# EAGLE design ESP8266-EVB_Rev_A (EAGLE 4.16)
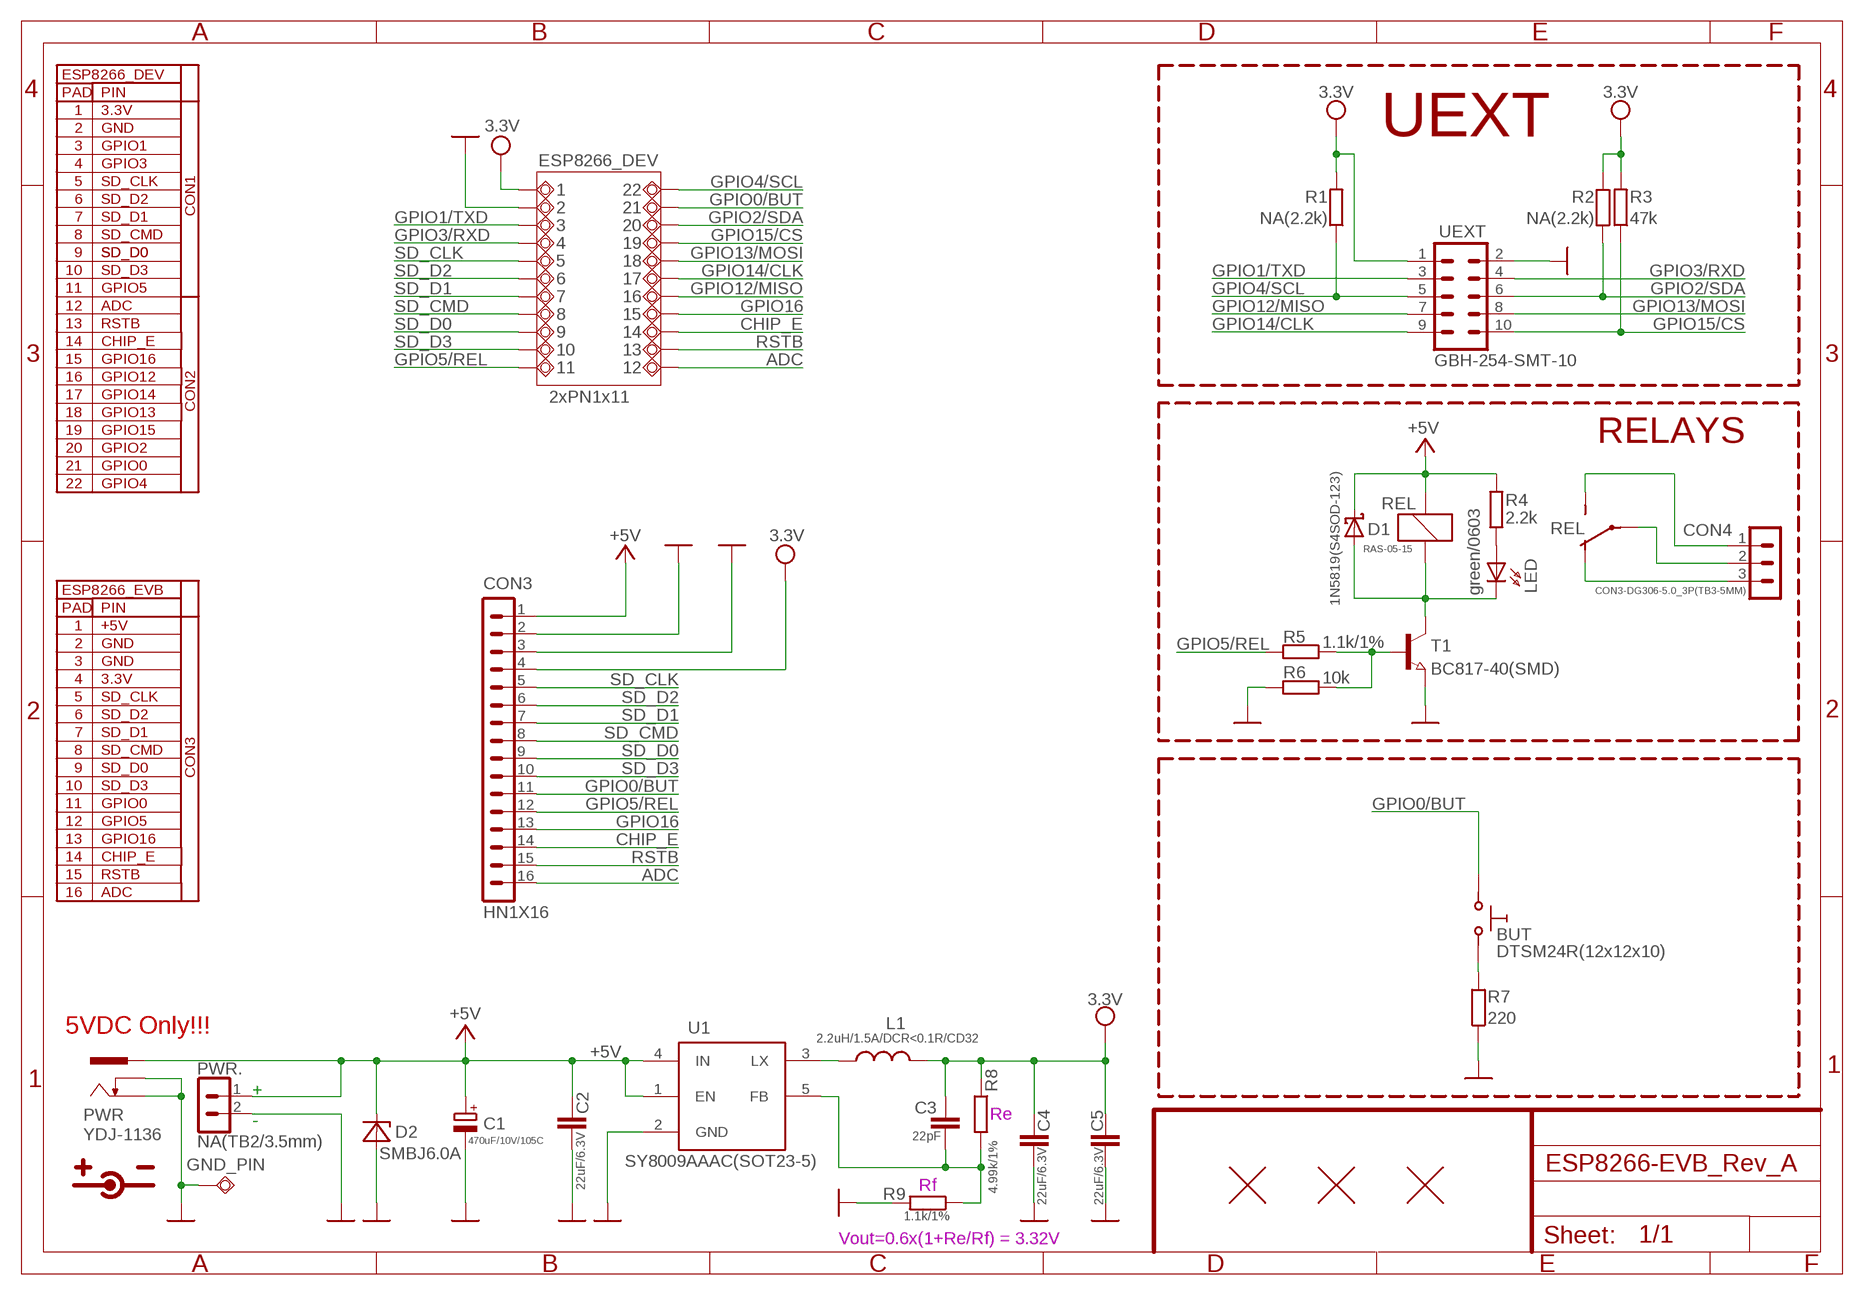
[diagram p0: schematic, sheet 1]

## Parts
1  TESTPAD40/60/SQUARE  [TESTPAD40/66/SQUARE]
2  TESTPAD40/66  [TESTPAD40/66]
3  TESTPAD40/66  [TESTPAD40/66]
4  TESTPAD40/66  [TESTPAD40/66]
5  TESTPAD40/66  [TESTPAD40/66]
6  TESTPAD40/66  [TESTPAD40/66]
7  TESTPAD40/66  [TESTPAD40/66]
8  TESTPAD40/66  [TESTPAD40/66]
9  TESTPAD40/66  [TESTPAD40/66]
10  TESTPAD40/66  [TESTPAD40/66]
11  TESTPAD40/66  [TESTPAD40/66]
12  TESTPAD40/66  [TESTPAD40/66]
13  TESTPAD40/66  [TESTPAD40/66]
14  TESTPAD40/66  [TESTPAD40/66]
15  TESTPAD40/66  [TESTPAD40/66]
16  TESTPAD40/66  [TESTPAD40/66]
17  TESTPAD40/66  [TESTPAD40/66]
18  TESTPAD40/66  [TESTPAD40/66]
19  TESTPAD40/66  [TESTPAD40/66]
20  TESTPAD40/66  [TESTPAD40/66]
21  TESTPAD40/66  [TESTPAD40/66]
22  TESTPAD40/66  [TESTPAD40/66]
BUT  DTSM24R(12x12x10)  SW-TAKTSS  [SW_TAKT12X12SS]
C1  470uF/10V/105C  CPOL-EUE2.5-6.3  [E2,5-6,3]
C2  22uF/6.3V  C-EUC0603_DWS  [C0603_DWS]
C3  22pF  C-EUC0603_DWS  [C0603_DWS]
C4  22uF/6.3V  C-EUC0603_DWS  [C0603_DWS]
C5  22uF/6.3V  C-EUC0603_DWS  [C0603_DWS]
CON3  HN1X16  CON16-HN1X16  [HN1X16]
CON4  CON3-DG306-5.0_3P(TB3-5MM)  [DG306-5.0_3P]
D1  1N5819(S4SOD-123)  SCHOTKKY7.62SS-1N5819(S4SOD-123)  [SOD-123]
D2  SMBJ6.0A  SMBJ16A  [DO214AA]
GND_PIN  TESTPAD3  [TEST_PAD40/70/SQUARE]
L1  2.2uH/1.5A/DCR<0.1R/CD32  L-CD32  [CD32]
LED  green/0603  LED0603DWS_L  [LED-0603_L]
PWR  YDJ-1136  PWR-JAKPWR_JACK_UNI_MILLING  [PWR_JACK_UNI_MILLING]
PWR.  NA(TB2/3.5mm)  CON2-DG306-5.0_2P(TB2-5MM)  [DG306-5.0_2P]
R1  NA(2.2k)  R-EU_R0603_5MIL_DWS  [R0603_5MIL_DWS]
R2  NA(2.2k)  R-EU_R0603_5MIL_DWS  [R0603_5MIL_DWS]
R3  47k  R-EU_R0603_5MIL_DWS  [R0603_5MIL_DWS]
R4  2.2k  R-EU_R0603_5MIL_DWS  [R0603_5MIL_DWS]
R5  1.1k/1%  R-EU_R0603_5MIL_DWS  [R0603_5MIL_DWS]
R6  10k  R-EU_R0603_5MIL_DWS  [R0603_5MIL_DWS]
R7  220  R-EU_R0603_5MIL_DWS  [R0603_5MIL_DWS]
R8  4.99k/1%  R-EU_R0603_5MIL_DWS  [R0603_5MIL_DWS]
R9  1.1k/1%  R-EU_R0603_5MIL_DWS  [R0603_5MIL_DWS]
REL  RAS-05-15  RELAYH200F  [H200-FAT]
T1  BC817-40(SMD)  NPN-TRANSISTOR_SOT23  [SOT23]
U1  SY8009AAAC(SOT23-5)  SY8008  [SOT23-5]
U$1  FIDUCIAL  [FIDUCIAL-1X3]
U$2  FIDUCIAL  [FIDUCIAL-1X3]
U$8  FIDUCIAL  [FIDUCIAL-1X3]
UEXT  GBH-254-SMT-10  ML10  [ML10-MALE]

## Nets
+5V: C1.+ C2.1 CON3.1 D1.C D2.C PWR.+ PWR..1 R4.2 REL.1 U1.1(EN) U1.4(IN)
ADC: 12.P$1(PP) CON3.16
CHIP_E: 14.P$1(PP) CON3.14
COM [REL]: CON4.2 REL.P(CONTACTS:P)
GND: 2.P$1(PP) C1.- C2.2 C4.2 C5.2 CON3.2 CON3.3 D2.A GND_PIN.P$1(PP) PWR.- PWR.-- PWR..2 R6.2 R7.1 R9.2 T1.2(E) U1.2(GND) UEXT.2
GPIO0/BUT: 21.P$1(PP) BUT.P$2 CON3.11
GPIO1/TXD: 3.P$1(PP) UEXT.3
GPIO2/SDA: 20.P$1(PP) R2.1 UEXT.6
GPIO3/RXD: 4.P$1(PP) UEXT.4
GPIO4/SCL: 22.P$1(PP) R1.1 UEXT.5
GPIO5/REL: 11.P$1(PP) CON3.12 R5.2
GPIO12/MISO: 16.P$1(PP) UEXT.7
GPIO13/MOSI: 18.P$1(PP) UEXT.8
GPIO14/CLK: 17.P$1(PP) UEXT.9
GPIO15/CS: 19.P$1(PP) R3.1 UEXT.10
GPIO16: 15.P$1(PP) CON3.13
N$1: LED.A R4.1
N$26: R5.1 R6.1 T1.1(B)
N$29: BUT.P$1 R7.2
N$44 [pwr2]: D1.A LED.C REL.2 T1.3(C)
N$64: L1.1 U1.3(LX)
N$66: C3.2 R8.2 R9.1 U1.5(FB)
NC [REL]: CON4.3 REL.O(CONTACTS:O)
NO [REL]: CON4.1 REL.S(CONTACTS:S)
RSTB: 13.P$1(PP) CON3.15
SD_CLK: 5.P$1(PP) CON3.5
SD_CMD: 8.P$1(PP) CON3.8
SD_D0: 9.P$1(PP) CON3.9
SD_D1: 7.P$1(PP) CON3.7
SD_D2: 6.P$1(PP) CON3.6
SD_D3: 10.P$1(PP) CON3.10
VCC: 1.P$1(PP) C3.1 C4.1 C5.1 CON3.4 L1.2 R1.2 R2.2 R3.2 R8.1 UEXT.1 ; supply symbol labelled 3.3V

## Notes on the sheet
- ESP8266_DEV
- PAD | PIN
- 1 | 3.3V
- 2 | GND | UEXT
- 3 | GPIO1
- 4 | GPIO3 | ESP8266_DEV
- 5 | SD_CLK
- 6 | SD_D2
- CON1
- 7 | SD_D1
- 8 | SD_CMD
- 9 | SD_D0 | SD_D0
- 10 | SD_D3
- 11 | GPIO5
- 12 | ADC
- 13 | RSTB
- 14 | CHIP_E
- 15 | GPIO16
- 16 | GPIO12
- 17 | GPIO14 | 2xPN1x11
- CON2
- 18 | GPIO13
- 19 | GPIO15
- RELAYS
- 20 | GPIO2
- 21 | GPIO0
- 22 | GPIO4
- ESP8266_EVB
- PAD | PIN
- 1 | +5V
- 2 | GND
- 3 | GND
- 4 | 3.3V
- 5 | SD_CLK
- 6 | SD_D2
- 7 | SD_D1
- 8 | SD_CMD
- 9 | SD_D0
- CON3
- 10 | SD_D3
- 11 | GPIO0
- 12 | GPIO5
- 13 | GPIO16
- 14 | CHIP_E
- 15 | RSTB
- 16 | ADC
- 5VDC Only!!!
- +
- -
- Re
- Rf
- Vout=0.6x(1+Re/Rf) = 3.32V

## Library data of the parts
1-22 GND_PIN = gogo:TESTPAD: drill 40mils, diameter 70mils
BUT = gogo:SW-TAKT
C1 = rcl:CPOL-EU: POLARIZED CAPACITOR, European symbol
C2-C5 = rcl:C-EU: CAPACITOR, European symbol
CON3 = Penko:CON16
CON4 = Penko:CON3
D1 = gogo:SCHOTKKY7.62SS
D2 = OLIMEX_DISCRET:SMBJ16A
L1 = OLIMEX_DISCRET:L
LED = DOUBLE-SIDE:LED
PWR = gogo:PWR-JAK
PWR. = Penko:CON2
R1-R9 = rcl:R-EU_: RESISTOR, European symbol
REL = DOUBLE-SIDE:RELAY: RELAY
T1 = semicon-smd-ipc:NPN-TRANSISTOR_: NPN TRANSISTOR
U1 = OLIMEX_IC:SY8008
U$1 U$2 U$8 = SparkFunEagle-6-6-07:FIDUCIAL: Fiducial Alignment Points Various fiducial points for machine vision alignment.
UEXT = con-harting-ml:ML10: HARTING

## Net classes
2 pwr2: width 0.508 mm
4 REL: width 2.032 mm, drill 2.54 mm

## Board
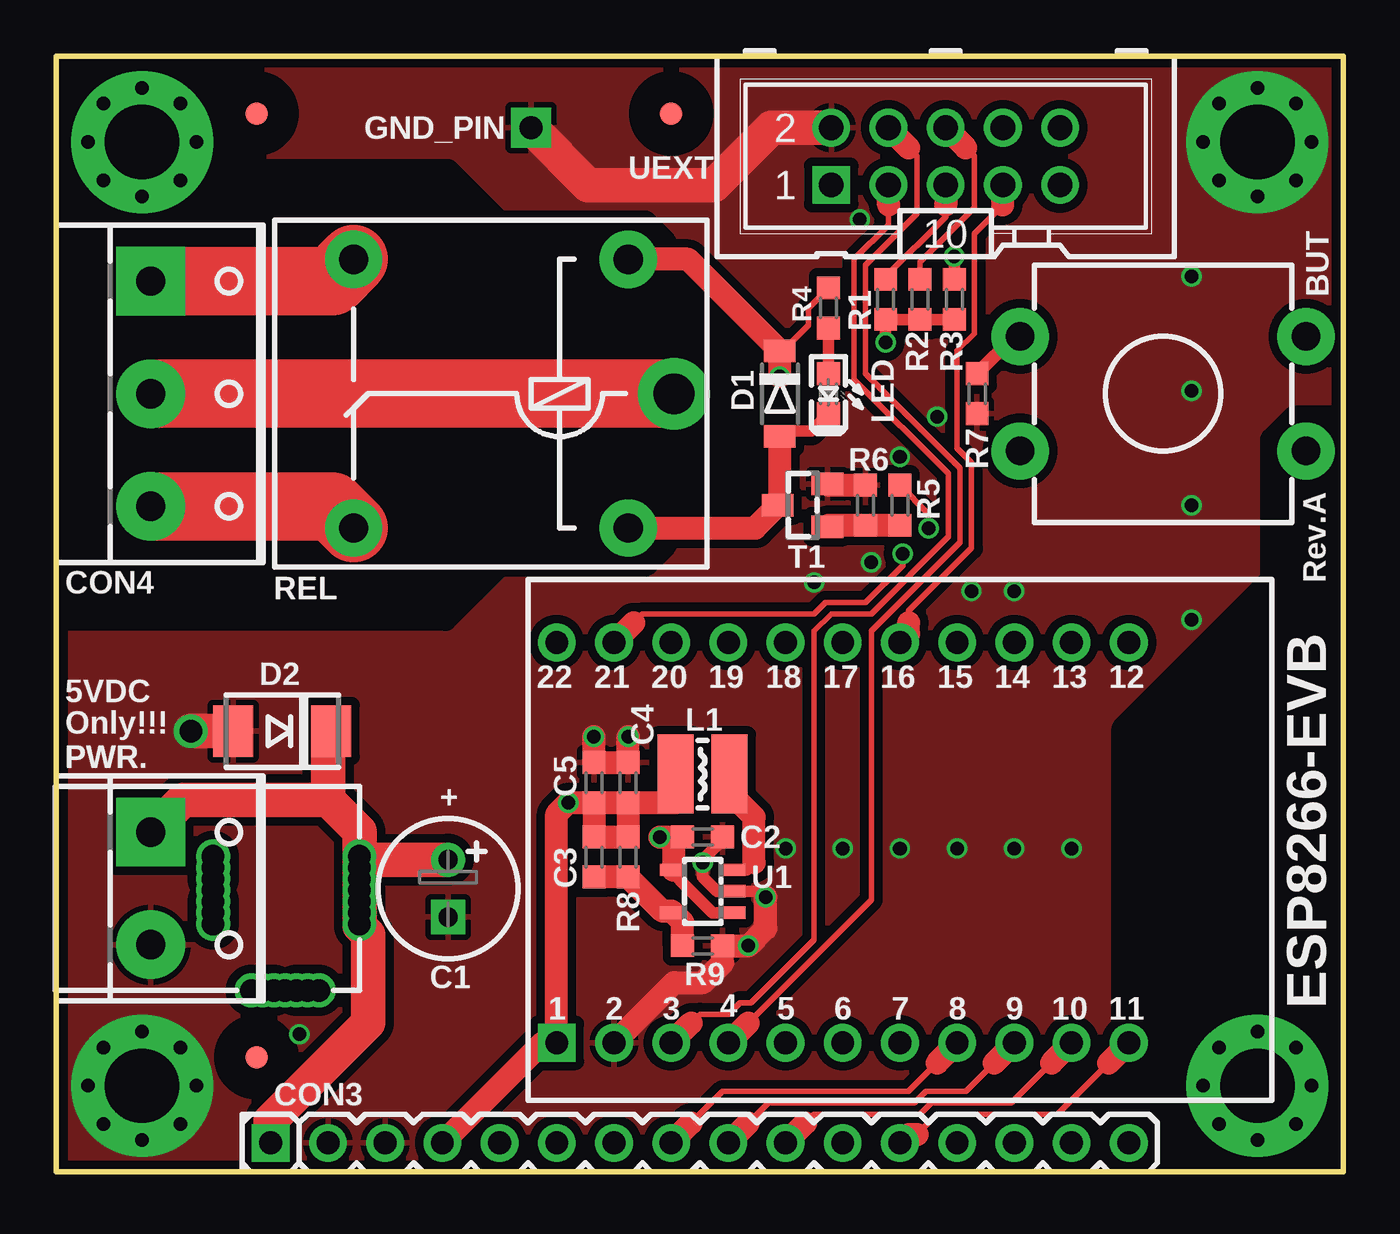
[diagram p1: board, top side]
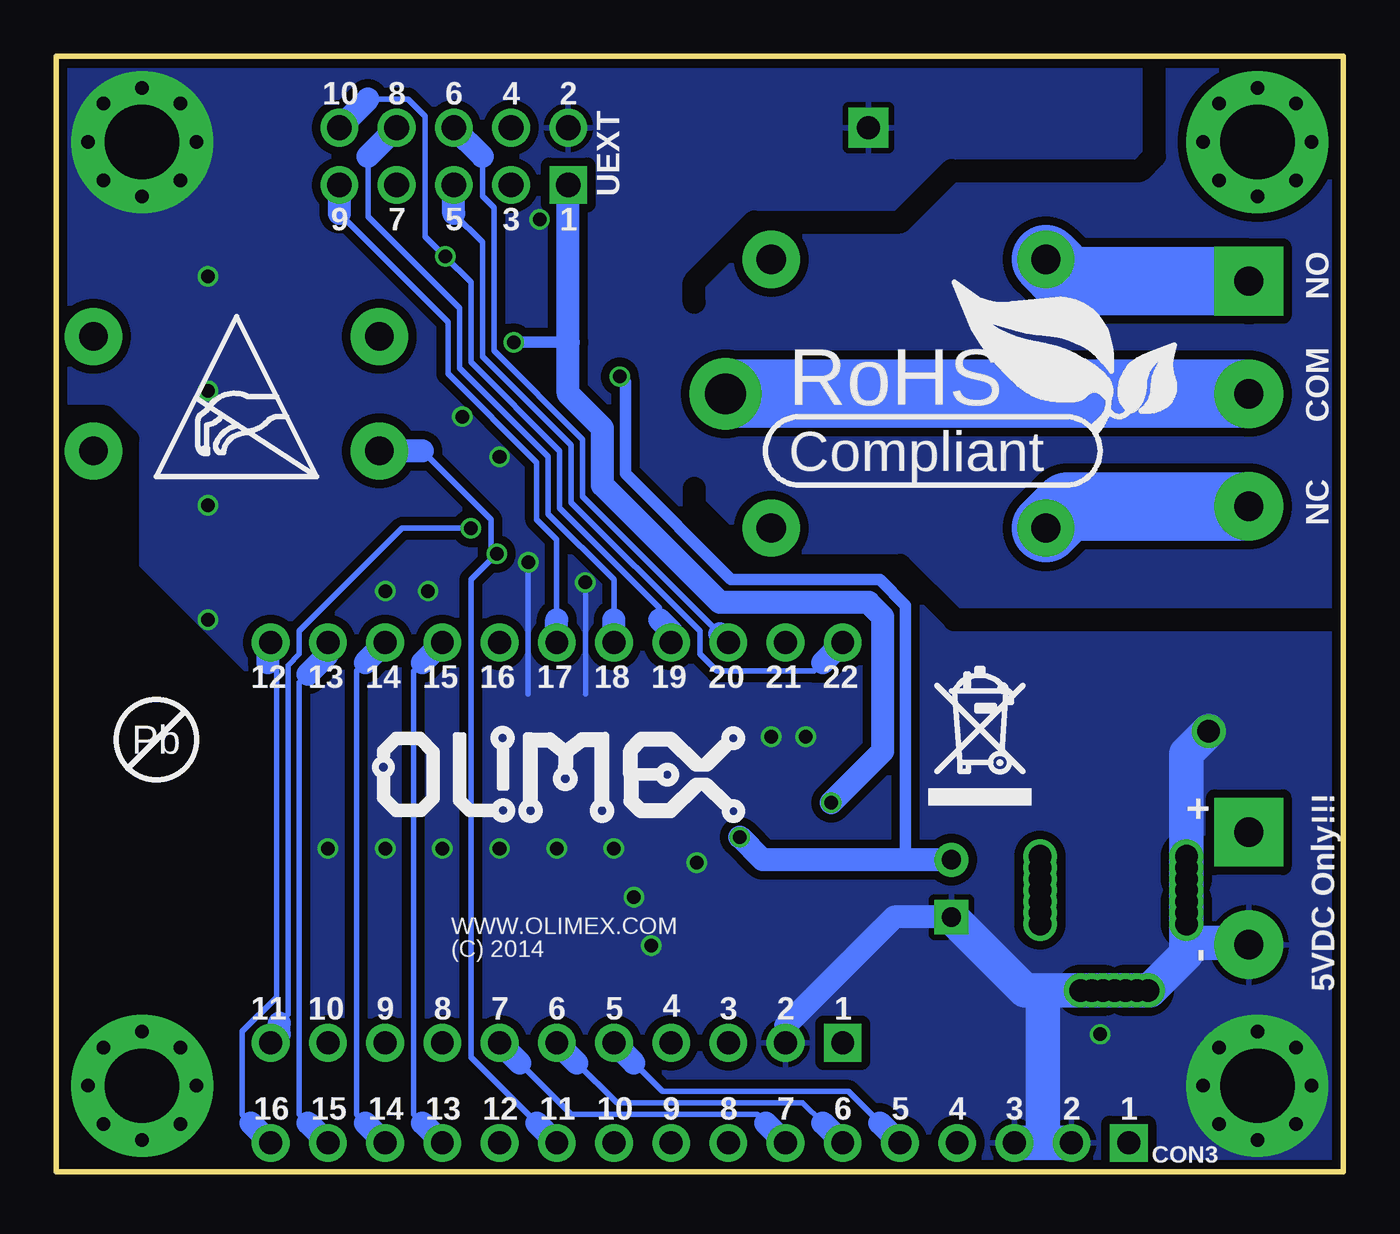
[diagram p2: board, bottom side, seen from below]

Size 57.15 x 49.53 mm. Coordinates in mm from the lower left corner, seen from the top.
Outline: 0,0 57.15,0 57.15,49.53 0,49.53 0,0
Copper layers (1+16): Top 0.035mm / dielectric 1.5mm / Bottom 0.035mm
Design rules "default": minimum track width 5mil, minimum drill 0.3mm, track to track 5mil, track to pad 5mil, pad to pad 5mil, via to via 5mil, smd to smd 1mil, copper to edge 5mil, drill to drill 8mil, minimum pad ring 6mil, minimum via ring 6mil, stop-mask expansion 2mil, vias tented up to drill 25mil, thermal gap 10mil
tRestrict: 17 lines
bRestrict: 17 lines

### Footprints (pad centres in the part's own frame; a part is rotated, then mirrored left to right if it is on the bottom)
TESTPAD40/66/SQUARE = drill 1.016 pad 1.676 square: P$1 0,0
TESTPAD40/66 = drill 1.016 pad 1.676 round: P$1 0,0
SW_TAKT12X12SS = drill 1.27 pad 2.54 round: P$1 -2.54,-6.35; P$2 2.54,-6.35; P$3 2.54,6.35; P$4 -2.54,6.35
E2,5-6,3 = drill 0.864 pad 1.524 round: + -1.27,0 | drill 0.864 pad 1.524 square: - 1.27,0
C0603_DWS = smd 1.016 x 1.016: 1 -0.889,0; 2 0.889,0
HN1X16 = drill 1.016 pad 1.676 square: 1 -17.78,0 | drill 1.016 pad 1.676 round: 2 -15.24,0; 3 -12.7,0; 4 -10.16,0; 5 -7.62,0; 6 -5.08,0; 7 -2.54,0; 8 0,0; 9 2.54,0; 10 5.08,0; 11 7.62,0; 12 10.16,0; 13 12.7,0; 14 15.24,0; 15 17.78,0; 16 20.32,0
DG306-5.0_3P = drill 1.3 pad 3.048 square: 1 -5,0 | drill 1.3 pad 3.048 round: 2 0,0; 3 5,0
SOD-123 = smd 1 x 1.4: A 1.9,0; C -1.9,0
DO214AA = smd 1.778 x 2.286: A 2.177,0; C -2.177,0
TEST_PAD40/70/SQUARE = drill 1.016 pad 1.778 square: P$1 0,0
CD32 = smd 1.6 x 3.5: 1 -1.2,0; 2 1.2,0
LED-0603_L = smd 1.016 x 1.016: A 0.889,0; C -0.889,0
PWR_JACK_UNI_MILLING = drill 1 round: + 0,4.75; +1 0,5.25; +2 0,5.75; +3 0,6.25; +4 0,4.25; +5 0,3.75; +6 0,3.25; - -6.5,4.75; -1 -6.5,5.25; -2 -6.5,5.75; -3 -6.5,4.25; -4 -6.5,3.75; -5 -6.5,6.25; -6 -6.5,3.25; -- -3.3,0.3; --1 -3.8,0.3; --2 -4.3,0.3; --3 -4.8,0.3; --4 -2.8,0.3; --5 -2.3,0.3; --6 -1.8,0.3
DG306-5.0_2P = drill 1.3 pad 3.048 square: 1 -2.5,0 | drill 1.3 pad 3.048 round: 2 2.5,0
R0603_5MIL_DWS = smd 1.016 x 1.016: 1 -0.889,0; 2 0.889,0
H200-FAT = drill 1.295 pad 2.54 round: 1 -7.493,-5.969; 2 -7.493,5.969; O 4.699,5.969; S 4.699,-5.969 | drill 1.803 pad 3.175 round: P -9.525,0
SOT23 = smd 1.4 x 1: 1 1.1,-0.95; 2 1.1,0.95; 3 -1.1,0
SOT23-5 = smd 1.2 x 0.55: 1 1.3,-0.95; 2 1.3,0; 3 1.3,0.95; 4 -1.3,0.95; 5 -1.3,-0.95
FIDUCIAL-1X3 = smd 1 x 1: 1 0,0
ML10-MALE = drill 1.1 pad 1.676 square: 1 -5.08,-1.27 | drill 1.1 pad 1.676 round: 2 -5.08,1.27; 3 -2.54,-1.27; 4 -2.54,1.27; 5 0,-1.27; 6 0,1.27; 7 2.54,-1.27; 8 2.54,1.27; 9 5.08,-1.27; 10 5.08,1.27

### Placement (x,y rotation side)
1  22.23,5.71 90 top
2  24.77,5.71 90 top
3  27.3,5.71 90 top
4  29.84,5.71 90 top
5  32.38,5.71 90 top
6  34.92,5.71 90 top
7  37.47,5.71 90 top
8  40.01,5.71 90 top
9  42.55,5.71 90 top
10  45.09,5.71 90 top
11  47.62,5.71 90 top
12  47.62,23.5 90 top
13  45.09,23.5 90 top
14  42.55,23.5 90 top
15  40.01,23.5 90 top
16  37.47,23.5 90 top
17  34.92,23.5 90 top
18  32.38,23.5 90 top
19  29.84,23.5 90 top
20  27.3,23.5 90 top
21  24.77,23.5 90 top
22  22.23,23.5 90 top
BUT  49.15,34.54 270 top
C1  17.4,12.57 270 top
C2  28.7,14.86 0 top
C3  23.88,13.97 270 top
C4  25.4,17.27 90 top
C5  23.88,17.27 90 top
CON3  27.3,1.27 0 top
CON4  4.19,34.54 270 top
D1  32.13,34.54 270 top
D2  10.03,19.56 180 top
GND_PIN  21.08,46.35 0 top
L1  28.7,17.65 180 top
LED  34.29,34.54 90 top
PWR  13.46,7.75 0 top
PWR.  4.19,12.57 270 top
R1  36.83,38.73 270 top
R2  38.35,38.73 270 top
R3  39.88,38.73 270 top
R4  34.29,38.35 90 top
R5  37.47,29.59 90 top
R6  35.94,29.59 90 top
R7  40.89,34.54 90 top
R8  25.4,13.97 270 top
R9  28.7,10.03 0 top
REL  17.91,34.54 180 top
T1  33.15,29.59 0 top
U1  28.7,12.45 0 top
U$1  8.89,46.99 180 top
U$2  8.89,5.08 180 top
U$4  [ESD_SYMBOL]  52.7,30.86 0 bottom
U$6  [PB_SMALL]  52.7,19.18 180 bottom
U$7  [RECYCLE_BIN1/8]  18.41,16.26 0 bottom
U$8  27.3,46.99 0 top
U$9  [ROHS]  24.64,31.11 0 bottom
U$10  [OLIMEX1_V]  25.4,15.37 0 bottom
UEXT  39.5,45.09 0 top

### Tracks (layer width: path | path; a pad name or v marks a point on that pad's centre or on a via)
+5V  (via drill 0.6)
  Top 0.254: D1.C 32.25,36.44 33.4,37.59 33.4,38.35 R4.2
  Top 0.508: U1.4 27.69,13.11 27.69,12.95 29.14,11.5 U1.1
  Top 1.016: 27.4,14.86 C2.1 | 27.4,14.86 U1.4 | v26.8,14.86 27.4,14.86 | REL.1 28.06,40.51 D1.C v32.13,35.31
  Top 1.524: PWR..1 5.63,16.51 12.06,16.51 | D2.C 12.06,19.41 12.06,16.51 | 13.46,13.84 PWR.+ 13.46,10.92 13.84,10.54 13.84,6.6 9.53,2.29 CON3.1 | 13.46,13.84 C1.+ | 13.46,13.84 13.46,15.11 12.06,16.51
  Bottom 0.508: v32.13,35.31 31.88,35.05 31.88,30.99 27.18,26.29 20.57,26.29 19.43,25.15 19.43,13.84
  Bottom 1.016: C1.+ 19.43,13.84 25.78,13.84 v26.8,14.86
ADC
  Bottom 0.254: 48.51,2.16 48.9,2.54 48.9,6.22 47.37,7.75 47.37,22.23 47.75,22.61
  Bottom 1.016: CON3.16 48.51,2.16 | 47.75,22.61 47.75,23.37 12.P$1
CHIP_E
  Bottom 0.254: 43.43,2.16 43.81,2.54 43.81,22.23 43.43,22.61
  Bottom 1.016: CON3.14 43.43,2.16 | 43.43,22.61 14.P$1
COM
  Top 3.048: CON4.2 17.53,34.54 REL.P
  Bottom 3.048: CON4.2 REL.P
GND  (via drill 0.6, 1, 3.3 pad 6.3)
  Top 0.508: v31.5,12.19 31.24,12.45 U1.2 29.34,12.45 28.7,13.08 v28.7,13.72 28.7,13.84 29.59,14.73 C2.2
  Top 1.016: T1.2 34.31,30.48 R6.2 | v31.5,12.19 31.5,10.79 v30.73,10.03 R9.2 29.59,9.27 28.7,8.38 27.43,8.38 2.P$1 | v25.4,19.3 C4.2 C5.2 v23.88,19.3
  Top 1.524: v5.97,19.56 D2.A | GND_PIN.P$1 23.62,43.81 29.21,43.81 31.75,46.35 UEXT.2
  Bottom 0.254: 36.2,21.21 v36.2,27.05 | 33.66,21.21 v33.66,26.16
  Bottom 1.016: 2.P$1 24.77,6.48 19.94,11.3 C1.-
  Bottom 1.524: PWR.- 6.96,9.68 8.59,8.05 PWR.-- 13.34,8.05 | PWR.- 6.96,10.16 4.19,10.16 PWR..2 | PWR.- 6.96,18.57 v5.97,19.56 | 13.34,8.05 14.14,8.05 C1.- | 13.34,8.05 13.34,1.27 | 13.34,1.27 CON3.2 | 13.34,1.27 CON3.3
  other vias: 3.81,3.81 1.4,3.81 2.1,5.52 3.81,6.22 5.52,5.52 6.22,3.81 5.52,2.1 3.81,1.4 2.1,2.1 53.34,45.72 50.93,45.72 51.63,47.43 53.34,48.13 55.05,47.43 55.75,45.72 55.05,44.01 53.34,43.31 51.63,44.01 37.47,31.75 40.01,14.35 42.55,14.35 45.09,14.35 40.64,25.78 42.55,25.78 34.92,14.35 37.47,14.35 32.38,14.35 10.79,6.1 35.69,42.29 39.12,33.53 50.42,24.51 50.42,29.59 50.42,34.67 50.42,39.75
  pour Top (isolate 0.381): -2.54,-2.54 -2.54,52.07 59.69,52.07 59.69,-2.54
  pour Bottom (isolate 0.381): -5.08,-5.08 -5.08,54.61 62.23,54.61 62.23,-5.08
GND0  (via drill 0.6, 3.3 pad 6.3)
  Top 1.016: v3.81,43.31 2.81,43.31 v2.1,44.01 1.4,44.72 v1.4,45.72 | v3.81,43.31 4.81,43.31 v5.52,44.01 6.22,44.72 v6.22,45.72 | v1.4,45.72 1.4,46.72 v2.1,47.43 2.81,48.13 v3.81,48.13 | v6.22,45.72 6.22,46.72 v5.52,47.43 4.81,48.13 v3.81,48.13 | v3.81,45.72 v3.81,48.13 | v3.81,43.31 v3.81,45.72 | v1.4,45.72 v3.81,45.72 | v3.81,45.72 v6.22,45.72
GND1  (via drill 0.6, 3.3 pad 6.3)
  Top 1.016: v53.34,1.4 52.34,1.4 v51.63,2.1 50.93,2.81 v50.93,3.81 | v53.34,1.4 54.34,1.4 v55.05,2.1 55.75,2.81 v55.75,3.81 | v50.93,3.81 50.93,4.81 v51.63,5.52 52.34,6.22 v53.34,6.22 | v55.75,3.81 55.75,4.81 v55.05,5.52 54.34,6.22 v53.34,6.22 | v53.34,3.81 v53.34,6.22 | v53.34,1.4 v53.34,3.81 | v50.93,3.81 v53.34,3.81 | v53.34,3.81 v55.75,3.81
GPIO0/BUT  (via drill 0.6)
  Top 0.254: 25.65,24.38 26.04,24.77 33.66,24.77 34.16,25.27 35.94,25.27 37.59,26.92 v37.59,27.43
  Top 1.016: 25.65,24.38 21.P$1
  Bottom 0.254: 40.89,32 37.85,28.96 37.85,27.69 v37.59,27.43 38.73,26.29 38.73,5.08 35.81,2.16
  Bottom 1.016: CON3.11 35.81,2.16 | 40.89,32 BUT.P$2
GPIO1/TXD
  Top 0.254: 28.19,6.6 28.57,6.99 29.84,6.99 30.35,7.49 30.86,7.49 33.66,10.29 33.66,24 34.42,24.77 36.2,24.77 39.62,28.19 39.62,30.99 35.43,35.18 35.43,40.51 36.96,42.04 36.96,42.93
  Top 1.016: 3.P$1 28.19,6.6 | 36.96,42.93 UEXT.3
GPIO2/SDA
  Top 0.254: R2.1 38.35,40.39 40.77,42.8 40.77,45.09 40.39,45.47
  Top 1.016: UEXT.6 40.39,45.47
  Bottom 0.254: 38.23,45.09 38.23,43.31 37.72,42.8 37.72,36.45 33.78,32.51 33.78,29.97 27.69,23.88
  Bottom 1.016: 38.23,45.09 UEXT.6 | 20.P$1 27.69,23.88
GPIO3/RXD
  Top 0.254: 30.73,6.6 36.2,12.06 36.2,24 40.13,27.94 40.13,31.24 35.94,35.43 35.94,40.26 38.23,42.55 38.23,45.09 37.85,45.47
  Top 1.016: 4.P$1 30.73,6.6 | 37.85,45.47 UEXT.4
GPIO4/SCL
  Top 0.254: 39.5,42.93 39.5,42.42 36.83,39.75 R1.1
  Top 1.016: UEXT.5 39.5,42.93
  Bottom 0.254: 23.11,22.61 23.5,22.23 27.81,22.23 28.57,22.99 28.57,24 34.29,29.72 34.29,32.26 38.23,36.2 38.23,41.27 39.5,42.55
  Bottom 1.016: 22.P$1 23.11,22.61 | 39.5,42.55 UEXT.5
GPIO5/REL  (via drill 0.6)
  Top 0.254: 38.23,1.65 39.12,2.54 44.45,2.54 46.74,4.83 | v38.73,28.57 38.73,29.21 R5.2
  Top 1.016: CON3.12 37.85,1.65 38.23,1.65 | 46.74,4.83 11.P$1
  Bottom 0.254: 47.24,6.6 46.86,6.99 46.86,22.48 46.35,22.99 46.35,24 41.78,28.57 v38.73,28.57
  Bottom 1.016: 11.P$1 47.24,6.1 47.24,6.6
GPIO12/MISO
  Top 0.254: 42.04,42.93 40.77,41.66 40.77,37.21 40.01,36.45 40.01,32.13 40.64,31.5 40.64,27.69 37.85,24.89 37.85,24.38
  Top 1.016: 42.04,42.93 UEXT.7 | 16.P$1 37.85,23.88 37.85,24.38
GPIO13/MOSI
  Bottom 0.254: 32.38,24.51 32.38,26.29 35.31,29.21 35.31,31.75 39.24,35.69 39.24,38.35 43.31,42.42 43.31,45.09
  Bottom 1.016: 18.P$1 32.38,24.51 | 43.31,45.09 UEXT.8
GPIO14/CLK
  Bottom 0.254: 44.58,42.55 39.75,37.72 39.75,35.43 35.81,31.5 35.81,28.96 34.92,28.07 34.92,24.51
  Bottom 1.016: 44.58,42.55 UEXT.9 | 17.P$1 34.92,24.51
GPIO15/CS  (via drill 0.6)
  Top 0.508: v39.88,40.64 R3.1
  Bottom 0.254: 43.31,47.62 41.53,47.62 40.77,46.86 40.77,41.53 v39.88,40.64 38.73,39.5 38.73,35.94 34.8,32 34.8,29.46 30.35,25.02 30.35,24.51
  Bottom 1.016: 43.31,47.62 UEXT.10 | 19.P$1 29.84,24 30.35,24.51
GPIO16
  Bottom 0.254: 40.89,2.16 41.27,2.54 41.27,22.23 40.89,22.61
  Bottom 1.016: CON3.13 40.89,2.16 | 40.89,22.61 15.P$1
N$1
  Top 0.508: LED.A R4.1
N$26
  Top 1.016: T1.1 34.31,28.7 R6.1 R5.1
N$29
  Top 0.61: BUT.P$1 42.55,37.08 R7.2
N$44
  Top 0.508: D1.A 32.38,32.89 33.53,32.89 LED.C
  Top 1.016: D1.A 32.13,29.59 T1.3 31.03,28.57 REL.2
N$64
  Top 0.508: U1.3 30.67,13.4 30.99,13.72
  Top 1.016: L1.1 29.9,16.83 30.99,15.75 30.99,13.72
N$66
  Top 1.016: C3.2 R8.2 26.92,11.56 27.34,11.56 U1.5 27.81,11.09 R9.1
NC
  Top 3.048: CON4.3 12.24,29.54 REL.O
  Bottom 3.048: CON4.3 12.24,29.54 REL.O
NO
  Top 3.048: CON4.1 12.24,39.54 REL.S
  Bottom 3.048: CON4.1 12.24,39.54 REL.S
RSTB
  Bottom 0.254: 45.97,2.16 46.35,2.54 46.35,21.72 45.97,22.1
  Bottom 1.016: CON3.15 45.97,2.16 | 45.97,22.1 45.09,22.99 13.P$1
SD_CLK
  Bottom 0.254: 20.57,2.16 21.97,3.56 30.23,3.56 31.5,4.83
  Bottom 1.016: CON3.5 20.57,2.16 | 31.5,4.83 5.P$1
SD_CMD
  Top 0.254: 28.19,2.16 29.59,3.56 37.85,3.56 39.12,4.83
  Top 1.016: CON3.8 28.19,2.16 | 39.12,4.83 8.P$1
SD_D0
  Top 0.254: 30.73,2.16 31.62,3.05 38.1,3.05 38.61,3.56 40.39,3.56 41.66,4.83
  Top 1.016: CON3.9 30.73,2.16 | 41.66,4.83 9.P$1
SD_D1
  Bottom 0.254: 25.65,2.16 26.04,2.54 34.29,2.54 36.58,4.83
  Bottom 1.016: CON3.7 25.65,2.16 | 36.58,4.83 7.P$1
SD_D2
  Bottom 0.254: 23.11,2.16 24,3.05 32.26,3.05 34.04,4.83
  Bottom 1.016: CON3.6 23.11,2.16 | 34.04,4.83 6.P$1
SD_D3
  Top 0.254: 33.27,2.16 33.66,2.54 38.35,2.54 38.86,3.05 42.42,3.05 44.2,4.83
  Top 1.016: CON3.10 33.27,2.16 | 44.2,4.83 10.P$1
VCC  (via drill 0.6)
  Top 0.508: R3.2 R2.2 R1.2 v36.83,36.83
  Top 1.016: CON3.4 21.59,5.71 1.P$1 22.23,15.88 v22.73,16.38 C5.1 | C5.1 C4.1 | C4.1 R8.1 C3.1 C5.1 | L1.2 27.5,16.38 C4.1
  Bottom 0.508: 34.42,36.83 v36.83,36.83
  Bottom 1.016: UEXT.1 34.42,36.83 34.42,34.54 32.89,33.02 32.89,30.48 27.69,25.27 21.08,25.27 20.45,24.64 20.45,18.67 v22.73,16.38

### Text on the board
Top: 133 Errors top
Bottom: 130 Errors bottom
tNames: Rev.A | 5VDC | Only!!! | + | ESP8266-EVB | 230 Errors total
bNames: 2 | 4 | 6 | 8 | 10 | 1 | 3 | 5 | 7 | 9 | NO | COM | NC | + | WWW.OLIMEX.COM | - | (C) 2014 | 5VDC Only!!! | 1 | 2 | 3 | 4 | 5 | 6 | 7 | 8 | 9 | 10 | 11 | 12 | 13 | 14 | 15 | 16
201bmp: C:/YASSEN_ON_C-YASSEN-REBORN/TASKS/MOD-nRF8001===P/Nordic_NRF8001/nRF8001-Gerber Files/with DCDC/!PICLIST-0909+++.BMP